# Altium project DIOT_EEM_Adapter.PrjPCB (part 2 of 2)

## Sheet Cpcis_connectors_P1_P6.SchDoc: DIOT_EEM_Adapter
size 420 x 297 mm; CheckedBy: -; DrawnBy: Marcin Kiepiela; Address1: Warsaw University of Technology; Address2: Nowowiejska 15/19 00-665 Warsaw; DocumentNumber: 2; SheetNumber: 2; SheetTotal: 6; EDA_Number: ARTIQ; Projet: ARTIQ/Sinara/DIOT; ModifiedBy: -; CheckedDate: -; Title2: -; DivGrp: ISE; Designer: Marcin Kiepiela; ModifiedDate: -; ProjectName: DIOT_EEM_Adapter.PrjPCB
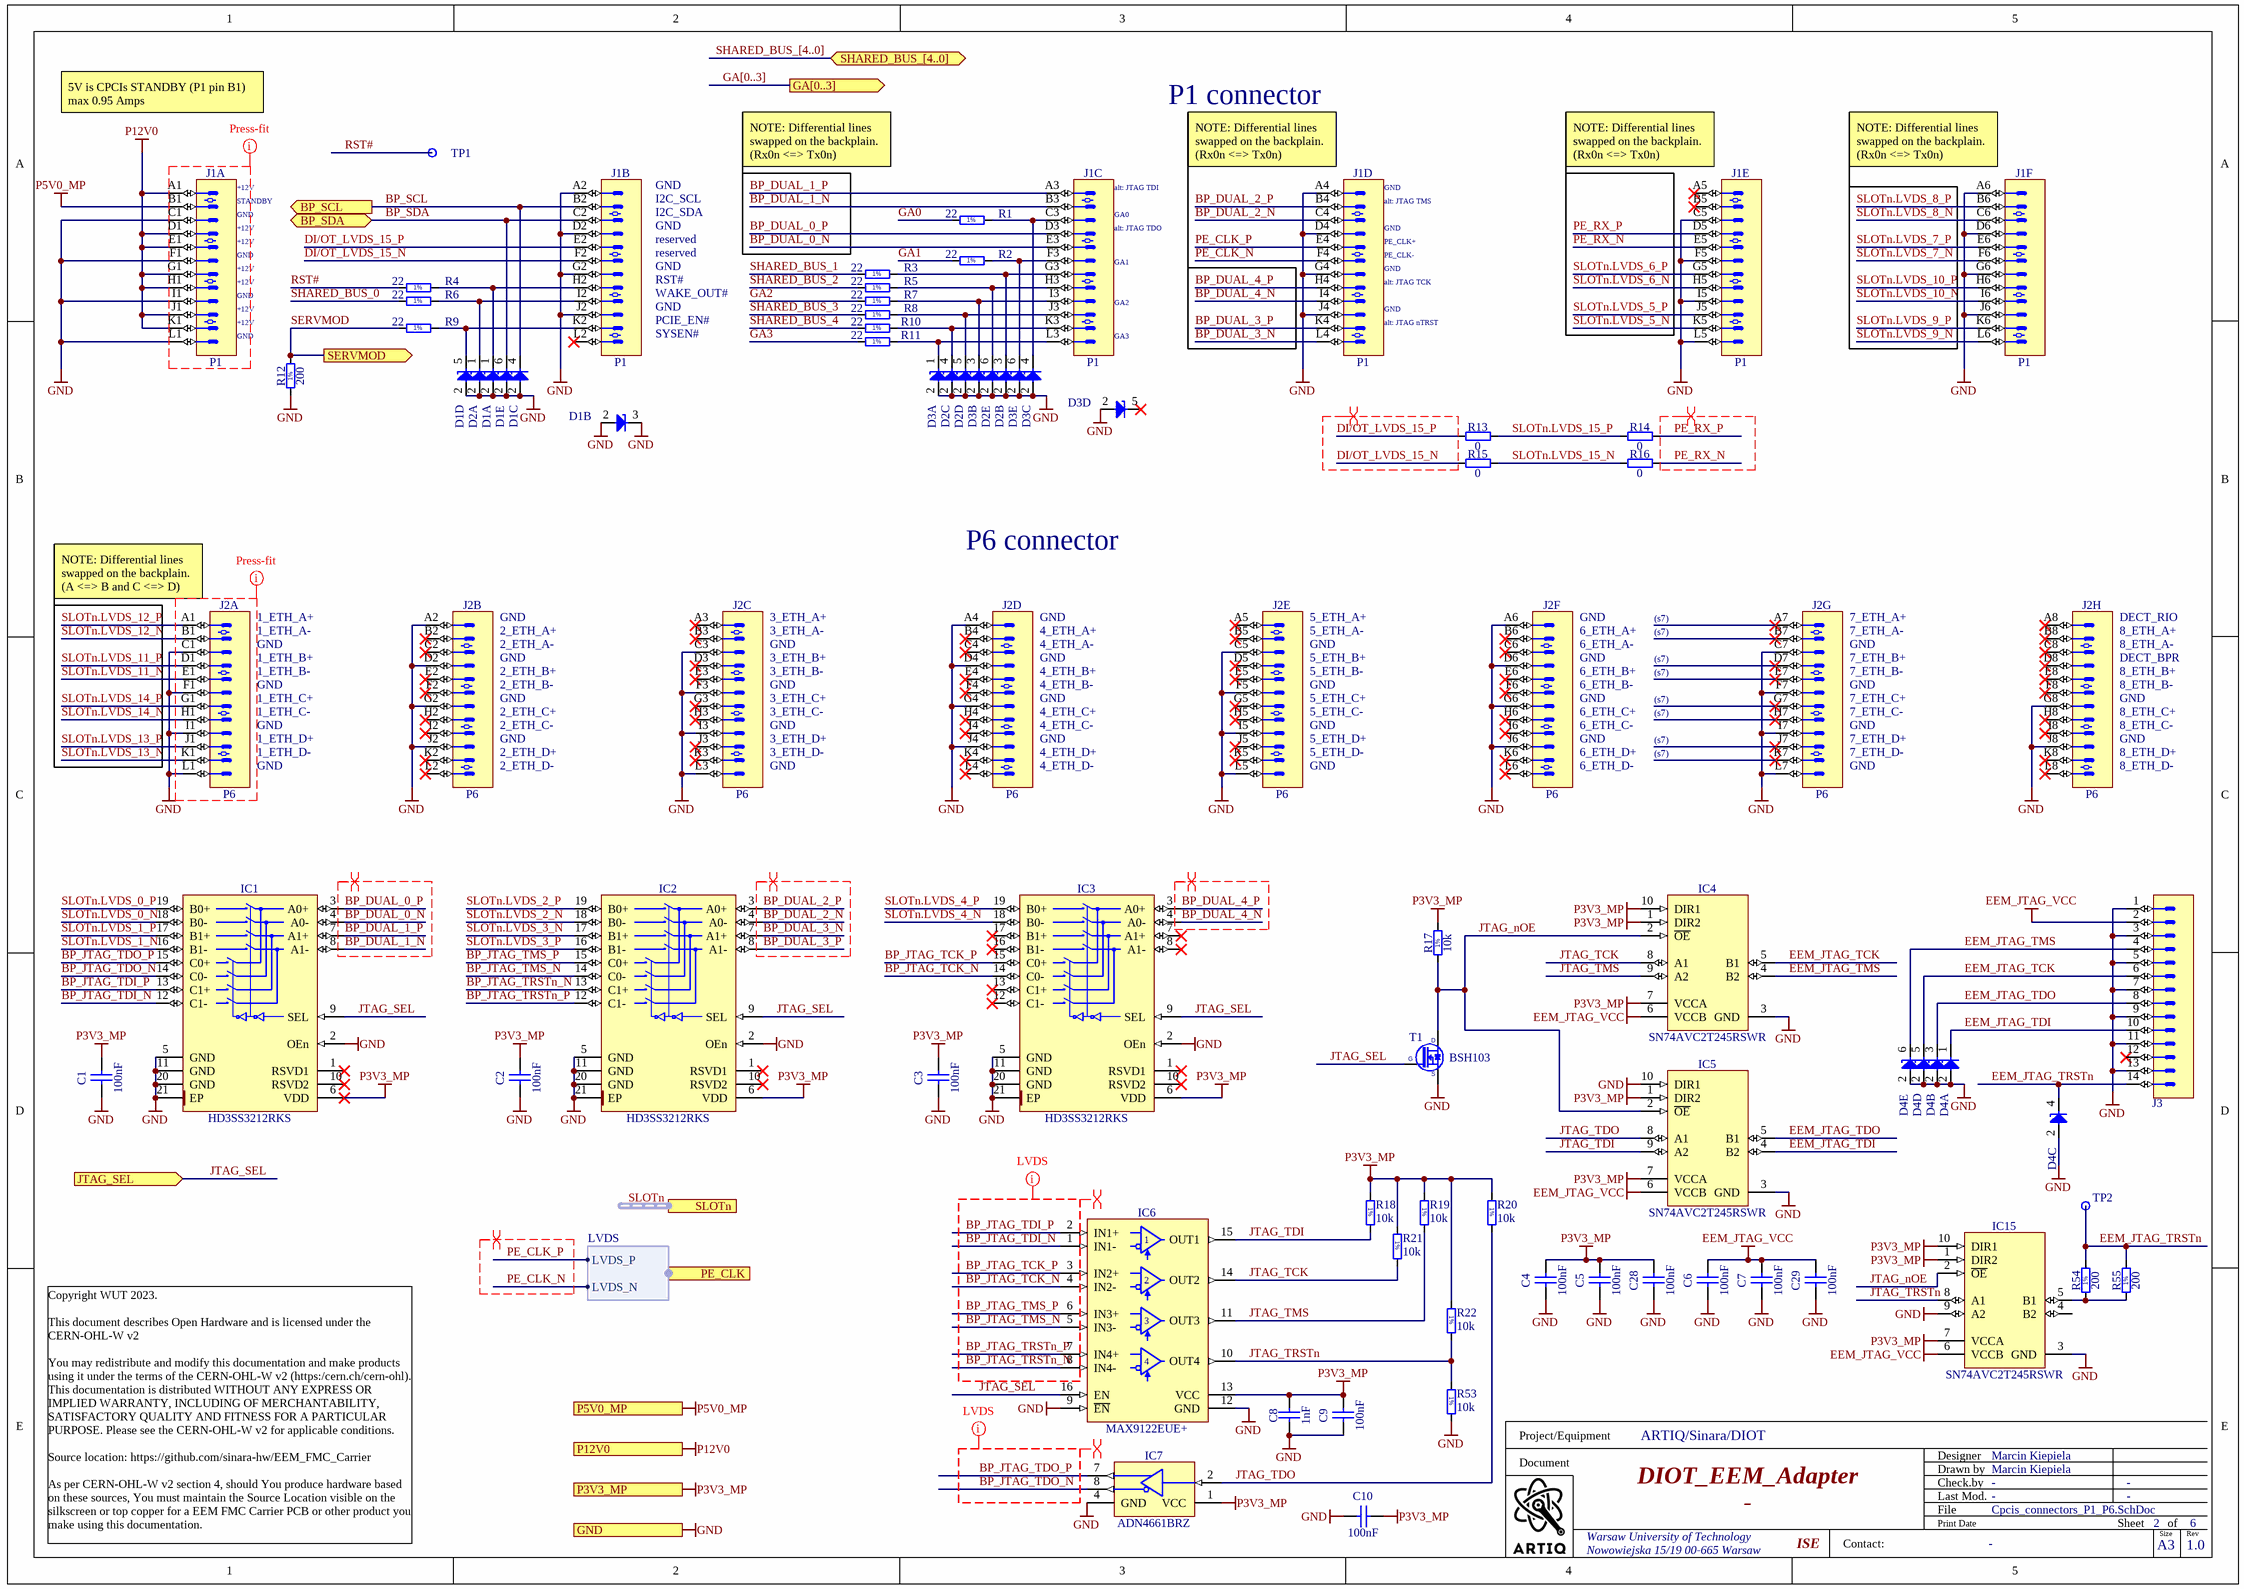
[diagram p3: Cpcis_connectors_P1_P6.SchDoc]

### Parts
C1  100nF  [CAPC1005X55N]
C2  100nF  [CAPC1005X55N]
C3  100nF  [CAPC1005X55N]
C4  100nF  [CAPC1005X55N]
C5  100nF  [CAPC1005X55N]
C6  100nF  [CAPC1005X55N]
C7  100nF  [CAPC1005X55N]
C8  1nF  [CAPC1005X55N]
C9  100nF  [CAPC1005X55N]
C10  100nF  [CAPC1005X55N]
C28  100nF  [CAPC1005X55N]
C29  100nF  [CAPC1005X55N]
D1  PESD3V3L5UY  [SOT65P210X110-6N]  (value not drawn)  (parts A,B,C,D,E of 5)
D2  PESD3V3L5UY  [SOT65P210X110-6N]  (value not drawn)  (parts A,B,C,D,E of 5)
D3  PESD3V3L5UY  [SOT65P210X110-6N]  (value not drawn)  (parts A,B,C,D,E of 5)
D4  PESD3V3L5UY  [SOT65P210X110-6N]  (value not drawn)  (parts A,B,C,D,E of 5)
IC1  HD3SS3212RKS  [TEXAS_RKS0020A]
IC2  HD3SS3212RKS  [TEXAS_RKS0020A]
IC3  HD3SS3212RKS  [TEXAS_RKS0020A]
IC4  SN74AVC2T245RSWR  [QFN40P140X180X55-10N]
IC5  SN74AVC2T245RSWR  [QFN40P140X180X55-10N]
IC6  MAX9122EUE+  [SOP65P640X110-16N]
IC7  ADN4661BRZ  [SOIC127P600X175-8N]
IC15  SN74AVC2T245RSWR  [QFN40P140X180X55-10N]
J1  P1  [AMPHENOL_10052825-101LF]  (parts A,B,C,D,E,F of 6)
J2  P6  [AMPHENOL_10052838-101LF]  (parts A,B,C,D,E,F,G,H of 8)
J3  Milli-Grid™  [MOLEX_87832-1420]  (value not drawn)
R1  22  [RESC1005X40N]
R2  22  [RESC1005X40N]
R3  22  [RESC1005X40N]
R4  22  [RESC1005X40N]
R5  22  [RESC1005X40N]
R6  22  [RESC1005X40N]
R7  22  [RESC1005X40N]
R8  22  [RESC1005X40N]
R9  22  [RESC1005X40N]
R10  22  [RESC1005X40N]
R11  22  [RESC1005X40N]
R12  200  [RESC1005X40N]
R13  0  [RESC0603X28N]
R14  0  [RESC0603X28N]
R15  0  [RESC0603X28N]
R16  0  [RESC0603X28N]
R17  10k  [RESC1005X40N]
R18  10k  [RESC1005X40N]
R19  10k  [RESC1005X40N]
R20  10k  [RESC1005X40N]
R21  10k  [RESC1005X40N]
R22  10k  [RESC1005X40N]
R53  10k  [RESC1005X40N]
R54  200  [RESC1005X40N]
R55  200  [RESC1005X40N]
T1  BSH103  [SOT95P230X110-3N]
TP1  Test Point  [TPS127]  (value not drawn)
TP2  Test Point  [TPS127]  (value not drawn)

### Ports
BP_SCL (out), BP_SDA (bidir), GA[0..3] (out), GND, JTAG_SEL (in), P3V3_MP (in), P5V0_MP (out), P12V0 (out), PE_CLK (harness LVDS), SERVMOD (out), SHARED_BUS_[4..0] (bidir), SLOTn (harness SLOT)

### Harnesses
LVDS: LVDS_P, LVDS_N

### Nets
EEM_JTAG_VCC: C6.2 C7.2 C29.2 IC4.6(VCCB) IC5.6(VCCB) IC15.6(VCCB) J3.2
GND: C1.1 C2.1 C3.1 C4.1 C5.1 C6.1 C7.1 C8.1 C9.1 C10.1 C28.1 C29.1 D1.2(A) D1.3(C) D2.2(A) D3.2(A) D4.2(A) IC1.2(OEn) IC1.5(GND) IC1.11(GND) IC1.20(GND) IC1.21(EP) IC2.2(OEn) IC2.5(GND) IC2.11(GND) IC2.20(GND) IC2.21(EP) IC3.2(OEn) IC3.5(GND) IC3.11(GND) IC3.20(GND) IC3.21(EP) IC4.3(GND) IC5.3(GND) IC5.10(DIR1) IC6.9(~{EN}) IC6.12(GND) IC7.4(GND) IC15.3(GND) IC15.9(A2) J1.A2 J1.A4 J1.A6 J1.C1 J1.C5 J1.D2 J1.D4 J1.D6 J1.F1 J1.F5 J1.G2 J1.G4 J1.G6 J1.I1 J1.I5 J1.J2 J1.J4 J1.J6 J1.L1 J1.L5 J2.A2 J2.A4 J2.A6 J2.C1 J2.C3 J2.C5 J2.C7 J2.D2 J2.D4 J2.D6 J2.F1 J2.F3 J2.F5 J2.F7 J2.G2 J2.G4 J2.G6 J2.G8 J2.I1 J2.I3 J2.I5 J2.I7 J2.J2 J2.J4 J2.J6 J2.J8 J2.L1 J2.L3 J2.L5 J2.L7 J3.1 J3.3 J3.5 J3.7 J3.9 J3.11 J3.13 R12.1 R53.1 T1.2(S) ; port GND
P3V3_MP: C1.2 C2.2 C3.2 C4.2 C5.2 C8.2 C9.2 C10.2 C28.2 IC1.6(VDD) IC2.6(VDD) IC3.6(VDD) IC4.1(DIR2) IC4.7(VCCA) IC4.10(DIR1) IC5.1(DIR2) IC5.7(VCCA) IC6.13(VCC) IC7.1(VCC) IC15.1(DIR2) IC15.7(VCCA) IC15.10(DIR1) R17.2 R18.2 R19.2 R20.2 R21.2 R22.2 ; port P3V3_MP
P5V0_MP: J1.B1 ; port P5V0_MP
P12V0: J1.A1 J1.D1 J1.E1 J1.G1 J1.H1 J1.J1 J1.K1 ; port P12V0
BP_DUAL_0_N: IC1.4(A0-) J1.E3  [project net BP_DUAL_0_N_2]
BP_DUAL_0_P: IC1.3(A0+) J1.D3  [project net BP_DUAL_0_P_2]
BP_DUAL_1_N: IC1.8(A1-) J1.B3  [project net BP_DUAL_1_N_2]
BP_DUAL_1_P: IC1.7(A1+) J1.A3  [project net BP_DUAL_1_P_2]
BP_DUAL_2_N: IC2.4(A0-) J1.C4  [project net BP_DUAL_2_N_2]
BP_DUAL_2_P: IC2.3(A0+) J1.B4  [project net BP_DUAL_2_P_2]
BP_DUAL_3_N: IC2.7(A1+) J1.L4  [project net BP_DUAL_3_N_2]
BP_DUAL_3_P: IC2.8(A1-) J1.K4  [project net BP_DUAL_3_P_2]
BP_DUAL_4_N: IC3.4(A0-) J1.I4  [project net BP_DUAL_4_N_2]
BP_DUAL_4_P: IC3.3(A0+) J1.H4  [project net BP_DUAL_4_P_2]
BP_JTAG_TCK_N: IC3.14(C0-) IC6.4(IN2-)  [project net BP_JTAG_TCK_N_2]
BP_JTAG_TCK_P: IC3.15(C0+) IC6.3(IN2+)  [project net BP_JTAG_TCK_P_2]
BP_JTAG_TDI_N: IC1.12(C1-) IC6.1(IN1-)  [project net BP_JTAG_TDI_N_2]
BP_JTAG_TDI_P: IC1.13(C1+) IC6.2(IN1+)  [project net BP_JTAG_TDI_P_2]
BP_JTAG_TDO_N: IC1.14(C0-) IC7.8(DOUT-)  [project net BP_JTAG_TDO_N_2]
BP_JTAG_TDO_P: IC1.15(C0+) IC7.7(DOUT+)  [project net BP_JTAG_TDO_P_2]
BP_JTAG_TMS_N: IC2.14(C0-) IC6.5(IN3-)  [project net BP_JTAG_TMS_N_2]
BP_JTAG_TMS_P: IC2.15(C0+) IC6.6(IN3+)  [project net BP_JTAG_TMS_P_2]
BP_JTAG_TRSTn_N: IC2.13(C1+) IC6.8(IN4-)  [project net BP_JTAG_TRSTn_N_2]
BP_JTAG_TRSTn_P: IC2.12(C1-) IC6.7(IN4+)  [project net BP_JTAG_TRSTn_P_2]
BP_SCL: D1.4(C) J1.B2 ; port BP_SCL
BP_SDA: D1.6(C) J1.C2 ; port BP_SDA
DI/OT_LVDS_15_N: J1.F2 R15.1  [project net DI/OT_LVDS_15_N_2]
DI/OT_LVDS_15_P: J1.E2 R13.1  [project net DI/OT_LVDS_15_P_2]
EEM_JTAG_TCK: D4.5(C) IC4.5(B1) J3.6  [project net EEM_JTAG_TCK_2]
EEM_JTAG_TDI: D4.1(C) IC5.4(B2) J3.10  [project net EEM_JTAG_TDI_2]
EEM_JTAG_TDO: D4.3(C) IC5.5(B1) J3.8  [project net EEM_JTAG_TDO_2]
EEM_JTAG_TMS: D4.6(C) IC4.4(B2) J3.4  [project net EEM_JTAG_TMS_2]
EEM_JTAG_TRSTn: D4.4(C) J3.14 R54.2 R55.2 TP2.1  [project net EEM_JTAG_TRSTn_2]
GA0: R1.1
GA1: R2.1
GA2: R7.1
GA3: R11.1
JTAG_nOE: IC4.2(~{OE}) IC5.2(~{OE}) IC15.2(~{OE}) R17.1 T1.3(D)  [project net JTAG_nOE_2]
JTAG_SEL: IC1.9(SEL) IC2.9(SEL) IC3.9(SEL) IC6.16(EN) T1.1(G) ; port JTAG_SEL
JTAG_TCK: IC4.8(A1) IC6.14(OUT2) R21.1  [project net JTAG_TCK_2]
JTAG_TDI: IC5.9(A2) IC6.15(OUT1) R18.1  [project net JTAG_TDI_2]
JTAG_TDO: IC5.8(A1) IC7.2(DIN) R20.1  [project net JTAG_TDO_2]
JTAG_TMS: IC4.9(A2) IC6.11(OUT3) R19.1  [project net JTAG_TMS_2]
JTAG_TRSTn: IC6.10(OUT4) IC15.8(A1) R22.1 R53.2  [project net JTAG_TRSTn_2]
PE_CLK_N: J1.F4 ; port PE_CLK.LVDS_N  [project net CK_MMCX_IN_N]
PE_CLK_P: J1.E4 ; port PE_CLK.LVDS_P  [project net CK_MMCX_IN_P]
PE_RX_N: J1.E5 R16.2  [project net PE_RX_N_2]
PE_RX_P: J1.D5 R14.2  [project net PE_RX_P_2]
RST#: R4.1 TP1.1  [project net RST#_2]
SERVMOD: R9.1 R12.2 ; port SERVMOD
SHARED_BUS_0: R6.1
SHARED_BUS_1: R3.1
SHARED_BUS_2: R5.1
SHARED_BUS_3: R8.1
SHARED_BUS_4: R10.1
SLOTn.LVDS_0_N: IC1.18(B0-)  [project net SLOTn.LVDS_0_N_2]
SLOTn.LVDS_0_P: IC1.19(B0+)  [project net SLOTn.LVDS_0_P_2]
SLOTn.LVDS_1_N: IC1.16(B1-)  [project net SLOTn.LVDS_1_N_2]
SLOTn.LVDS_1_P: IC1.17(B1+)  [project net SLOTn.LVDS_1_P_2]
SLOTn.LVDS_2_N: IC2.18(B0-)  [project net SLOTn.LVDS_2_N_2]
SLOTn.LVDS_2_P: IC2.19(B0+)  [project net SLOTn.LVDS_2_P_2]
SLOTn.LVDS_3_N: IC2.17(B1+)  [project net SLOTn.LVDS_3_N_2]
SLOTn.LVDS_3_P: IC2.16(B1-)  [project net SLOTn.LVDS_3_P_2]
SLOTn.LVDS_4_N: IC3.18(B0-)  [project net SLOTn.LVDS_4_N_2]
SLOTn.LVDS_4_P: IC3.19(B0+)  [project net SLOTn.LVDS_4_P_2]
SLOTn.LVDS_5_N: J1.K5  [project net SLOTn.LVDS_5_N_2]
SLOTn.LVDS_5_P: J1.J5  [project net SLOTn.LVDS_5_P_2]
SLOTn.LVDS_6_N: J1.H5  [project net SLOTn.LVDS_6_N_2]
SLOTn.LVDS_6_P: J1.G5  [project net SLOTn.LVDS_6_P_2]
SLOTn.LVDS_7_N: J1.F6  [project net SLOTn.LVDS_7_N_2]
SLOTn.LVDS_7_P: J1.E6  [project net SLOTn.LVDS_7_P_2]
SLOTn.LVDS_8_N: J1.C6  [project net SLOTn.LVDS_8_N_2]
SLOTn.LVDS_8_P: J1.B6  [project net SLOTn.LVDS_8_P_2]
SLOTn.LVDS_9_N: J1.L6  [project net SLOTn.LVDS_9_N_2]
SLOTn.LVDS_9_P: J1.K6  [project net SLOTn.LVDS_9_P_2]
SLOTn.LVDS_10_N: J1.I6  [project net SLOTn.LVDS_10_N_2]
SLOTn.LVDS_10_P: J1.H6  [project net SLOTn.LVDS_10_P_2]
SLOTn.LVDS_11_N: J2.E1  [project net SLOTn.LVDS_11_N_2]
SLOTn.LVDS_11_P: J2.D1  [project net SLOTn.LVDS_11_P_2]
SLOTn.LVDS_12_N: J2.B1  [project net SLOTn.LVDS_12_N_2]
SLOTn.LVDS_12_P: J2.A1  [project net SLOTn.LVDS_12_P_2]
SLOTn.LVDS_13_N: J2.K1  [project net SLOTn.LVDS_13_N_2]
SLOTn.LVDS_13_P: J2.J1  [project net SLOTn.LVDS_13_P_2]
SLOTn.LVDS_14_N: J2.H1  [project net SLOTn.LVDS_14_N_2]
SLOTn.LVDS_14_P: J2.G1  [project net SLOTn.LVDS_14_P_2]
SLOTn.LVDS_15_N: R15.2 R16.1  [project net SLOTn.LVDS_15_N_2]
SLOTn.LVDS_15_P: R13.2 R14.1  [project net SLOTn.LVDS_15_P_2]
NetD1_1: D1.1(C) J1.H2 R4.2
NetD1_5: D1.5(C) J1.K2 R9.2
NetD2_1: D2.1(C) J1.I2 R6.2
NetD2_3: D2.3(C) J1.G3 R3.2
NetD2_4: D2.4(C) J1.K3 R10.2
NetD2_5: D2.5(C) J1.J3 R8.2
NetD2_6: D2.6(C) J1.H3 R5.2
NetD3_1: D3.1(C) J1.L3 R11.2
NetD3_3: D3.3(C) J1.I3 R7.2
NetD3_4: D3.4(C) J1.C3 R1.2
NetD3_6: D3.6(C) J1.F3 R2.2
NetIC15_5: IC15.5(B1) R54.1 R55.1

Not connected (* = marked no-connect by the designer): D3 5(C)*; IC1 1(RSVD1)* 10(RSVD2)*; IC2 1(RSVD1)* 10(RSVD2)*; IC3 1(RSVD1)* 7(A1+)* 8(A1-)* 10(RSVD2)* 12(C1-)* 13(C1+)* 16(B1-)* 17(B1+)*; IC7 3(NC) 5(NC) 6(NC); IC15 4(B2); J1 A5* B5* L2*; J2 A3* A5* A7* A8* B2* B3* B4* B5* B6* B7* B8* C2* C4* C6* C8* D3* D5* D7* D8* E2* E3* E4* E5* E6* E7* E8* F2* F4* F6* F8* G3* G5* G7* H2* H3* H4* H5* H6* H7* H8* I2* I4* I6* I8* J3* J5* J7* K2* K3* K4* K5* K6* K7* K8* L2* L4* L6* L8*; J3 12*

### Buses and harness runs
bus GA[0..3] = port GA[0..3]
bus SHARED_BUS_[4..0] = port SHARED_BUS_[4..0]
harness SLOTn = port SLOTn

### Layout directives
differential pair: BP_DUAL_0_N, BP_DUAL_0_P, BP_DUAL_1_N, BP_DUAL_1_P, BP_DUAL_2_N, BP_DUAL_2_P, BP_DUAL_3_N, BP_DUAL_3_P, BP_DUAL_4_N, BP_DUAL_4_P, BP_JTAG_TCK_N, BP_JTAG_TCK_P, BP_JTAG_TDI_N, BP_JTAG_TDI_P, BP_JTAG_TDO_N, BP_JTAG_TDO_P, BP_JTAG_TMS_N, BP_JTAG_TMS_P, BP_JTAG_TRSTn_N, BP_JTAG_TRSTn_P, DI/OT_LVDS_15_N, DI/OT_LVDS_15_P, PE_CLK_N, PE_CLK_P, PE_RX_N, PE_RX_P
net class LVDS: BP_JTAG_TCK_N, BP_JTAG_TCK_P, BP_JTAG_TDI_N, BP_JTAG_TDI_P, BP_JTAG_TDO_N, BP_JTAG_TDO_P, BP_JTAG_TMS_N, BP_JTAG_TMS_P, BP_JTAG_TRSTn_N, BP_JTAG_TRSTn_P
CompClassName: Press-fit: (no net found under the mark)

### Notes on the sheet
- 5V is CPCIs STANDBY (P1 pin B1)
  max 0.95 Amps
- P1 connector
- (near J1) +12V
- GND
- NOTE: Differential lines swapped on the backplain.
  (Rx0n <=> Tx0n)
- (near J1) alt: JTAG TDI
- (near J1) NOTE: Differential lines swapped on the backplain.
  (Rx0n <=> Tx0n)
- (near J1) GND
- (near J1) STANDBY
- I2C_SCL
- I2C_SDA
- reserved
- (near J1) alt: JTAG TDO
- (near J1) GA1
- (near J1) GA0
- (near J1) alt: JTAG TMS
- (near J1) PE_CLK+
- (near J1) PE_CLK-
- +12V
- RST#
- WAKE_OUT#
- PCIE_EN#
- (near J1) GA2
- (near J1) alt: JTAG TCK
- (near J1) alt: JTAG nTRST
- SYSEN#
- (near J1) GA3
- (near J2) NOTE: Differential lines swapped on the backplain.
  (A <=> B and C <=> D)
- P6 connector
- (near J2) 1_ETH_A+
- (near J2) 1_ETH_A-
- (near J2) GND
- (near J2) 1_ETH_B+
- (near J2) 2_ETH_A+
- (near J2) 2_ETH_A-
- (near J2) 3_ETH_A+
- (near J2) 3_ETH_A-
- (near J2) 3_ETH_B+
- (near J2) 4_ETH_A+
- (near J2) 4_ETH_A-
- (near J2) 5_ETH_A+
- (near J2) 5_ETH_A-
- (near J2) 5_ETH_B+
- (near J2) 6_ETH_A+
- (near J2) 6_ETH_A-
- (s7)
- (near J2) 7_ETH_A+
- (near J2) 7_ETH_A-
- (near J2) 7_ETH_B+
- (near J2) DECT_RIO
- (near J2) 8_ETH_A+
- (near J2) 8_ETH_A-
- (near J2) DECT_BPR
- (near J2) 1_ETH_B-
- (near J2) 1_ETH_C+
- (near J2) 1_ETH_C-
- (near J2) 2_ETH_B+
- (near J2) 2_ETH_B-
- (near J2) 2_ETH_C+
- (near J2) 2_ETH_C-
- (near J2) 3_ETH_B-
- (near J2) 3_ETH_C+
- (near J2) 3_ETH_C-
- (near J2) 4_ETH_B+
- (near J2) 4_ETH_B-
- (near J2) 4_ETH_C+
- (near J2) 4_ETH_C-
- (near J2) 5_ETH_B-
- (near J2) 5_ETH_C+
- (near J2) 5_ETH_C-
- (near J2) 6_ETH_B+
- (near J2) 6_ETH_B-
- (near J2) 6_ETH_C+
- (near J2) 6_ETH_C-
- (near J2) 7_ETH_B-
- (near J2) 7_ETH_C+
- (near J2) 7_ETH_C-
- (near J2) 8_ETH_B+
- (near J2) 8_ETH_B-
- (near J2) 8_ETH_C+
- (near J2) 8_ETH_C-
- (near J2) 1_ETH_D+
- (near J2) 1_ETH_D-
- (near J2) 2_ETH_D+
- (near J2) 2_ETH_D-
- (near J2) 3_ETH_D+
- (near J2) 3_ETH_D-
- (near J2) 4_ETH_D+
- (near J2) 4_ETH_D-
- (near J2) 5_ETH_D+
- (near J2) 5_ETH_D-
- (near J2) 6_ETH_D+
- (near J2) 6_ETH_D-
- (near J2) 7_ETH_D+
- (near J2) 7_ETH_D-
- (near J2) 8_ETH_D+
- (near J2) 8_ETH_D-
- Project/Equipment
- Document
- Designer
- Drawn by
- Check.by
- Copyright WUT 2023.
  This document describes Open Hardware and is licensed under the CERN-OHL-W v2
  You may redistribute and modify this documentation and make products using it under the terms of the CERN-OHL-W v2 (https:/cern.ch/cern-ohl). This documentation is distributed WITHOUT ANY EXPRESS OR IMPLIED WARRANTY, INCLUDING OF MERCHANTABILITY, SATISFACTORY QUALITY AND FITNESS FOR A PARTICULAR PURPOSE. Please see the CERN-OHL-W v2 for applicable conditions.
  Source location: https://github.com/sinara-hw/EEM_FMC_Carrier
  As per CERN-OHL-W v2 section 4, should You produce hardware based on these sources, You must maintain the Source Location visible on the silkscreen or top copper for a EEM FMC Carrier PCB or other product you make using this documentation.
- Contact:
- File
- Last Mod.
- Print Date
- Sheet
- Size
- A3
- of
- Rev
- (in symbol R0402_10K_1%_0.0625W_100PPM) 1%
- (in symbol R0402_22R_1%_0.0625W_100PPM) 1%
- (in symbol R0402_200R_1%_0.0625W_100PPM) 1%

### Library data of the parts
C1-C7 C9 C10 C28 C29 = CC0402_100NF_16V_10%_X7R: Non-polarised capacitor; Part Description: SMD Multilayer Chip Ceramic Capacitor; Manufacturer: GENERIC; Manufacturer1 Part Number: GRM155R71C104KA88D; Voltage: 16V; TC: X7R; Tolerance: ±10%; Part Number: CC0402_100NF_16V_10%_X7R; Component Kind: Standard; Component Type: Standard; Pin Count: 2; Value: 100nF; Status: Not Recommended; Manufacturer Part Number: CC0402_100NF_16V_10%_X7R; Case: 0402; Mounted: Yes; Socket: No; SMD: Yes; Sense: No; HelpURL: \\cern.ch\dfs\Applications\Altium\Datasheets\CC0402_X7R_MURATA_GRM.pdf; Author: CERN DEM JLC; CreateDate: 05.12.2013; LatestRevisionDate: 03.12.2007; Manufacturer1 Example: MURATA; Manufacturer1 ComponentHeight: 0.55mm
C8 = CC0402_1NF_50V_10%_X7R: Non-polarised capacitor; Manufacturer: GENERIC; Part Description: SMD Multilayer Chip Ceramic Capacitor; Manufacturer1 Part Number: 223858715623; Tolerance: ±10%; Voltage: 50V; TC: X7R; Manufacturer Part Number: CC0402_1NF_50V_10%_X7R; Part Number: CC0402_1NF_50V_10%_X7R; Value: 1nF; Component Kind: Standard; Component Type: Standard; Pin Count: 2; Status: Not Recommended; Case: 0402; Mounted: Yes; Socket: No; SMD: Yes; Sense: No; Manufacturer1 Example: PHYCOMP; Manufacturer1 ComponentHeight: 0.55mm; HelpURL: \\cern.ch\dfs\Applications\Altium\Datasheets\CC0402_X7R_PHYCOMP.pdf; Author: CERN DEM JLC; CreateDate: 03.12.2007; LatestRevisionDate: 03.12.2007
D1-D4 = PESD3V3L5UY: Fivefold ESD Protection Diode Arrays; Part Description: Fivefold ESD Protection Diode Arrays (30kV); Manufacturer: NEXPERIA; Voltage: 3.3V; Power: 200W; PressFit: No; Bonding: No; Part Number: PESD3V3L5UY; Component Kind: Standard; Component Type: Standard; Device: PESD3V3L5UY; PackageDescription: SOT363, SC-88, 0.65mm Pitch; 6 Pin, 1.25mm W X 2.00mm L X 1.10mm H body, IPC Medium Density; Manufacturer Part Number: PESD3V3L5UY; Pin Count: 6; Case: SOT363; Mounted: Yes; Socket: No; SMD: Yes; Sense: No; ComponentHeight: 1.1mm; HelpURL: \\cern.ch\dfs\Applications\Altium\Datasheets\PESD3V3L5UY.pdf; Author: CERN DEM WB; CreateDate: 05.07.2021; LatestRevisionDate: 05.07.2021
IC1-IC3 = HD3SS3212RKS: Two-Channel Differential 2:1/1:2 USB3.1 Mux/Demux; Manufacturer: TEXAS INSTRUMENTS; PressFit: No; Bonding: No; Part Number: HD3SS3212RKS; Component Kind: Standard; Component Type: Standard; Device: HD3SS3212RKS; PackageDescription: QFN, TEXAS Case Style RKS, 0.50mm Pitch, Rect.; 20 Pin, 2.50mm L X 4.50mm W X 1.00mm H body (w/Thermal Tab 1.1mm X 3.1mm); Part Description: Two-Channel Differential 2:1/1:2 USB3.1 Mux/Demux; Manufacturer Part Number: HD3SS3212RKS; Pin Count: 21; Case: TQFN20; Mounted: Yes; Socket: No; SMD: Yes; Sense: No; ComponentHeight: 1mm; Author: CERN DEM BC; HelpURL: \\cern.ch\dfs\Applications\Altium\Datasheets\HD3SS3212RKS.pdf; CreateDate: 2019-11-06; LatestRevisionDate: 2019-11-06
IC4 IC5 IC15 = SN74AVC2T245RSWR: Dual-Bit Dual-Supply Bus Transceiver With Configurable Voltage Translation and 3-State Outputs; Manufacturer: TEXAS INSTRUMENTS; PressFit: No; Bonding: No; Part Number: SN74AVC2T245RSWR; Component Kind: Standard; Component Type: Standard; Device: SN74AVC2T245RSWR; PackageDescription: QFN, 0.40mm Pitch, Rect.;10 Pin, 1.80mm L X 1.40mm W X 0.55mm H Body, IPC Medium Density; Status: Not Recommended; Part Description: Dual-Bit Dual-Supply Bus Transceiver With Configurable Voltage Translation and 3-State Outputs; Manufacturer Part Number: SN74AVC2T245RSWR; Pin Count: 10; Case: QFN10; Mounted: Yes; Socket: No; SMD: Yes; Sense: No; ComponentHeight: 0.55mm; Author: CERN DEM JLC; HelpURL: \\cern.ch\dfs\Applications\Altium\Datasheets\SN74AVC2T245RSWR.pdf; CreateDate: 07.07.2014; LatestRevisionDate: 30.03.2017
IC6 = MAX9122EUE+: Quad LVDS Line Receivers with Integrated Termination and Flow-Through Pinout; Manufacturer: MAXIM; PressFit: No; Bonding: No; Part Number: MAX9122EUE+; Component Kind: Standard; Component Type: Standard; Device: MAX9122EUE+; PackageDescription: SOP, 0.65mm Pitch; 16 Pin, 4.40mm W X 5.00mm L X 1.10mm H body, IPC Medium Density; Part Description: Quad LVDS Line Receivers with Integrated Termination and Flow-Through Pinout; Manufacturer Part Number: MAX9122EUE+; Pin Count: 16; Case: TSSOP16; Mounted: Yes; Socket: No; SMD: Yes; Sense: No; ComponentHeight: 1.1mm; Author: CERN DEM MR; HelpURL: \\cern.ch\dfs\Applications\Altium\Datasheets\MAX9122EUE+.pdf; CreateDate: 2015-12-14; LatestRevisionDate: 2015-12-14
IC7 = ADN4661BRZ: Single, 3V, CMOS, LVDS, High Speed Differential Driver; Manufacturer: ANALOG DEVICES; PressFit: No; Bonding: No; Part Number: ADN4661BRZ; Component Kind: Standard; Component Type: Standard; Device: ADN4661BRZ; PackageDescription: SOIC 8, Pitch 1.27mm - Body 4x5mm, IPC Medium Density; Part Description: Single, 3V, CMOS, LVDS, High Speed Differential Driver; Manufacturer Part Number: ADN4661BRZ; Pin Count: 8; Case: SOIC8; Mounted: Yes; Socket: No; SMD: Yes; Sense: No; ComponentHeight: 1.75mm; Author: CERN DEM JMW; HelpURL: \\cern.ch\dfs\Applications\Altium\Datasheets\ADN4661BRZ.pdf; CreateDate: 2014-02-26; LatestRevisionDate: 2014-02-26
J1 = AMPHENOL_10052825-101LF: 72 Contacts Header, 6 Columns, 4 Pairs per Column; Part Description: 72 Contacts, 2mm Pitch, 6 Columns, 4 Pairs per Column, 4 Walls, Right Angle Header; Part Number: AMPHENOL_10052825-101LF; Component Kind: Standard; Component Type: Standard; Pin Count: 72; Family: AirMax VS; Mounted: Yes; Socket: No; SMD: No; PressFit: Yes; Sense: No; Status: None; Manufacturer: AMPHENOL; Manufacturer Part Number: 10052825-101LF; ComponentHeight: 15.35mm; HelpURL: \\cern.ch\dfs\Applications\Altium\Datasheets\AMPHENOL_10052825-101LF.pdf; ComponentLink1URL: \\cern.ch\dfs\Applications\Altium\Datasheets\AMPHENOL_10052825-101LF_Application.pdf; ComponentLink1Description: Application; Author: CERN DEM MR; CreateDate: 19/02/2018; LatestRevisionDate: 19/02/2018; Classname: Overlapping
J2 = AMPHENOL_10052838-101LF: 96 Contacts Header, 8 Columns, 4 Pairs per Column; Part Description: 96 Contacts, 2mm Pitch, 8 Columns, 4 Pairs per Column, 4 Walls, Right Angle Header; Part Number: AMPHENOL_10052838-101LF; Component Kind: Standard; Component Type: Standard; Pin Count: 96; Family: AirMax VS; Mounted: Yes; Socket: No; SMD: No; PressFit: Yes; Sense: No; Status: None; Manufacturer: AMPHENOL; Manufacturer Part Number: 10052838-101LF; ComponentHeight: 15.35mm; HelpURL: \\cern.ch\dfs\Applications\Altium\Datasheets\AMPHENOL_10052838-101LF.pdf; ComponentLink1URL: \\cern.ch\dfs\Applications\Altium\Datasheets\AMPHENOL_10052838-101LF_Application.pdf; ComponentLink1Description: Application; Author: CERN DEM MR; CreateDate: 19/02/2018; LatestRevisionDate: 19/02/2018; Classname: Overlapping
J3 = MOLEX_87832-1420: Connector 14 Male; Part Description: 2.00mm (.079") Pitch Milli-Grid™ Header, Surface Mount, Vertical, Shrouded, 14 Circuits,with Locking Windows and Centre Polarization Slot, PCB Locator; Manufacturer: MOLEX; PressFit: No; Part Number: MOLEX_87832-1420; Component Kind: Standard; Component Type: Standard; Pin Count: 14; Family: Milli-Grid™; Mounted: Yes; Socket: No; SMD: Yes; Sense: No; Status: None; Manufacturer Part Number: 87832-1420; ComponentHeight: 7.6mm; HelpURL: \\cern.ch\dfs\Applications\Altium\Datasheets\MOLEX_87832-1420.pdf; Author: CERN DEM JLC; CreateDate: 09.09.2008; LatestRevisionDate: 09.09.2008
R1-R11 = R0402_22R_1%_0.0625W_100PPM: Resistor - 1%; Part Description: General Purpose Thick Film Chip Resistor; Manufacturer: GENERIC; Manufacturer1 Part Number: 232270672209L; TC: ±100ppm/°C; PressFit: No; Part Number: R0402_22R_1%_0.0625W_100PPM; Component Kind: Standard; Component Type: Standard; Pin Count: 2; Value: 22; Status: Not Recommended; Power: 0.0625W; Tolerance: ±1%; Manufacturer Part Number: R0402_22R_1%_0.0625W_100PPM; Case: 0402; Mounted: Yes; Socket: No; SMD: Yes; Manufacturer1 Example: YAGEO PHYCOMP; Manufacturer1 ComponentHeight: 0.4mm; HelpURL: \\cern.ch\dfs\Applications\Altium\Datasheets\R0402_Phycomp_RC0402.pdf; Author: CERN DEM JLC; CreateDate: 03.12.2007; LatestRevisionDate: 17.10.2012; Sense: No
R12 R54 R55 = R0402_200R_1%_0.0625W_100PPM: Resistor - 1%; Part Description: General Purpose Thick Film Chip Resistor; Manufacturer: GENERIC; Manufacturer1 Part Number: 232270672001L; TC: ±100ppm/°C; PressFit: No; Part Number: R0402_200R_1%_0.0625W_100PPM; Component Kind: Standard; Component Type: Standard; Pin Count: 2; Value: 200; Status: Not Recommended; Power: 0.0625W; Tolerance: ±1%; Manufacturer Part Number: R0402_200R_1%_0.0625W_100PPM; Case: 0402; Mounted: Yes; Sense: No; Socket: No; SMD: Yes; Manufacturer1 Example: YAGEO PHYCOMP; Manufacturer1 ComponentHeight: 0.4mm; HelpURL: \\cern.ch\dfs\Applications\Altium\Datasheets\R0402_Phycomp_RC0402.pdf; Author: CERN DEM JLC; CreateDate: 2007-12-03; LatestRevisionDate: 2012-10-17
R13-R16 = R0201_0R_JUMPER: Resistor; Part Description: 1A (0.05R Max DC Resistance) Zero Ohm Jumper; Manufacturer: GENERIC; Manufacturer1 Part Number: CRCW02010000Z0ED; PressFit: No; Part Number: R0201_0R_JUMPER; Component Kind: Standard; Component Type: Standard; Pin Count: 2; Value: 0; Status: Not Recommended; Manufacturer Part Number: R0201_0R_JUMPER; Case: 0201; Mounted: Yes; Sense: No; Socket: No; SMD: Yes; Manufacturer1 Example: VISHAY; Manufacturer1 ComponentHeight: 0.27mm; HelpURL: \\cern.ch\dfs\Applications\Altium\Datasheets\R0201_VISHAY_CRCW e3.pdf; Author: CERN DEM JLC; CreateDate: 19.11.2014; LatestRevisionDate: 08.01.2015
R17 = R0402_10K_1%_0.0625W_100PPM: Resistor - 1%; Part Description: General Purpose Thick Film Chip Resistor; Manufacturer: GENERIC; Manufacturer1 Part Number: 232270671003L; TC: ±100ppm/°C; PressFit: No; Part Number: R0402_10K_1%_0.0625W_100PPM; Component Kind: Standard; Component Type: Standard; Pin Count: 2; Value: 10k; Status: Not Recommended; Power: 0.0625W; Tolerance: ±1%; Manufacturer Part Number: R0402_10K_1%_0.0625W_100PPM; Case: 0402; Mounted: Yes; Sense: No; Socket: No; SMD: Yes; Manufacturer1 Example: YAGEO PHYCOMP; Manufacturer1 ComponentHeight: 0.4mm; HelpURL: \\cern.ch\dfs\Applications\Altium\Datasheets\R0402_Phycomp_RC0402.pdf; Author: CERN DEM JLC; CreateDate: 2007-12-03; LatestRevisionDate: 2012-10-17
R18-R22 R53 = R0402_10K_1%_0.0625W_100PPM: Resistor - 1%; Part Description: General Purpose Thick Film Chip Resistor; Manufacturer: GENERIC; Manufacturer1 Part Number: 232270671003L; TC: ±100ppm/°C; Part Number: R0402_10K_1%_0.0625W_100PPM; Component Kind: Standard; Component Type: Standard; Pin Count: 2; Value: 10k; Status: Not recommended; Power: 0.0625W; Tolerance: ±1%; Manufacturer Part Number: R0402_10K_1%_0.0625W_100PPM; Case: 0402; Mounted: Yes; Sense: No; Socket: No; SMD: Yes; Manufacturer1 Example: YAGEO PHYCOMP; Manufacturer1 ComponentHeight: 0.4mm; HelpURL: \\cern.ch\dfs\Applications\Altium\Datasheets\R0402_Phycomp_RC0402.pdf; Author: CERN DEM JLC; CreateDate: 03.12.2007; LatestRevisionDate: 17.10.2012
T1 = BSH103: N-CHANNEL MOSFET WITH DIODE; Part Description: 30V 850mA N-Channel Enhancement Mode Field-Effect Transistor; Manufacturer: NEXPERIA; PressFit: No; Bonding: No; Part Number: BSH103; Component Kind: Standard; Component Type: Standard; Device: BSH103; PackageDescription: SOT23, 3 pin, Pitch 0.95mm - 1.3mm W X 2.9mm L X 1.1mm H, IPC Medium Density; Manufacturer Part Number: BSH103; Pin Count: 3; Case: SOT23-3; Mounted: Yes; Socket: No; SMD: Yes; Sense: No; ComponentHeight: 1.1mm; HelpURL: \\cern.ch\dfs\Applications\Altium\Datasheets\BSH103.pdf; Author: CERN DEM JLC; CreateDate: 16.03.2010; LatestRevisionDate: 20.06.2017; ClassName: Artix
TP1 TP2 = SMD_PAD_1.27X1.27MM: Part Description: 1.27mm x 1.27mm PCB Copper Area (SMD Test Point); Mounted: No; Part Number: SMD_PAD_1.27X1.27MM; Component Kind: Standard (No BOM); Component Type: Standard (No BOM); Pin Count: 1; Family: Test Point; Socket: No; SMD: No; Sense: No; Status: None; ComponentHeight: 0mm; HelpURL: Undefined; Author: CERN DEM JLC; CreateDate: 12.01.2008; LatestRevisionDate: 12.01.2008; PackageDescription: 1.27mm x 1.27mm PCB Copper Area (SMD Test Point)

## Sheet Supply.SchDoc: DIOT_EEM_Adapter
size 420 x 297 mm; CheckedBy: -; DrawnBy: Marcin Kiepiela; Address1: Warsaw University of Technology; Address2: Nowowiejska 15/19 00-665 Warsaw; DocumentNumber: 5; SheetNumber: 5; SheetTotal: 6; EDA_Number: ARTIQ; Projet: ARTIQ/Sinara/DIOT; ModifiedBy: -; CheckedDate: -; Title2: -; DivGrp: ISE; Designer: Marcin Kiepiela; ModifiedDate: -; ProjectName: DIOT_EEM_Adapter.PrjPCB
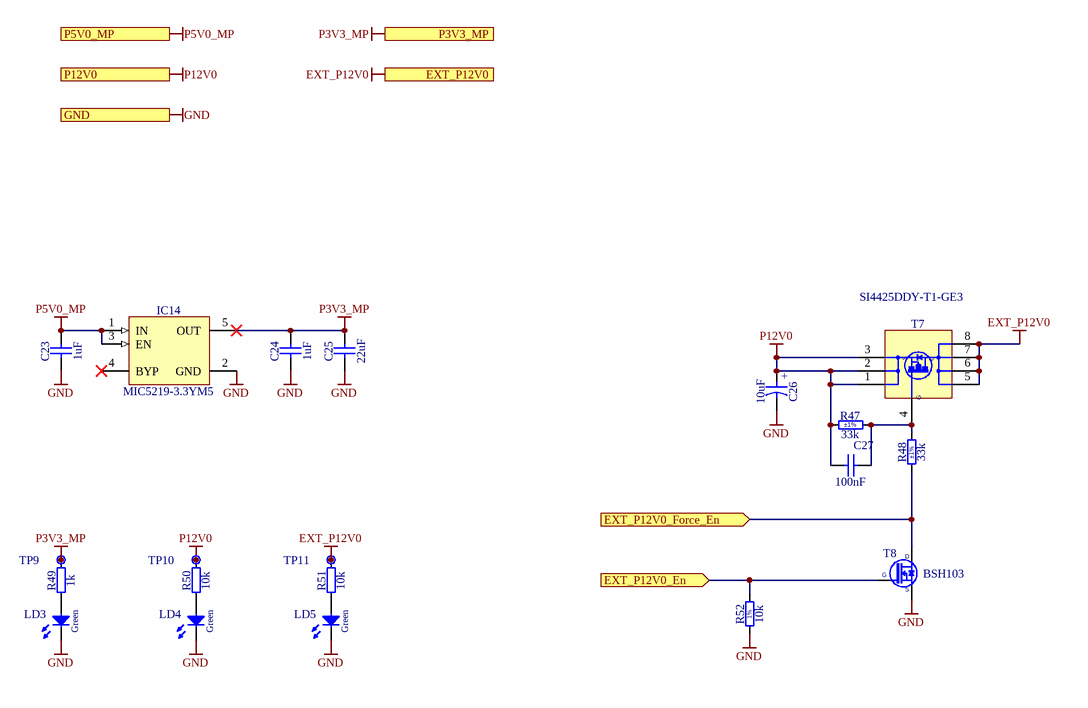
[diagram p4: Supply.SchDoc]

### Parts
C23  1uF  [CAPC1608X87N]
C24  1uF  [CAPC1608X87N]
C25  22uF  [CAPC1608X90N]
C26  10uF  [CAPMP6032X280N]
C27  100nF  [CAPC1005X55N]
IC14  MIC5219-3.3YM5  [SOT95P280X145-5N]
LD3  Green  [LED_KINGBRIGHT_KPH-1608CGCK]
LD4  Green  [LED_KINGBRIGHT_KPH-1608CGCK]
LD5  Green  [LED_KINGBRIGHT_KPH-1608CGCK]
R47  33k  Tolerance: ±1%  [RESC1005X40N]
R48  33k  Tolerance: ±1%  [RESC1005X40N]
R49  1k  [RESC1005X40N]
R50  10k  [RESC1005X40N]
R51  10k  [RESC1005X40N]
R52  10k  [RESC1005X40N]
T7  SI4425DDY-T1-GE3  [SOIC127P600X175-8N]
T8  BSH103  [SOT95P230X110-3N]
TP9  Test Point  [TPS127]  (value not drawn)
TP10  Test Point  [TPS127]  (value not drawn)
TP11  Test Point  [TPS127]  (value not drawn)

### Ports
EXT_P12V0 (out), EXT_P12V0_En (in), EXT_P12V0_Force_En (in), GND, P3V3_MP (out), P5V0_MP (in), P12V0 (in)

### Nets
EXT_P12V0: R51.2 T7.5(D) T7.6(D) T7.7(D) T7.8(D) TP11.1 ; port EXT_P12V0
GND: C23.1 C24.1 C25.1 C26.2 IC14.2(GND) LD3.1(C) LD4.1(C) LD5.1(C) R52.1 T8.2(S) ; port GND
P3V3_MP: C24.2 C25.2 IC14.5(OUT) R49.2 TP9.1 ; port P3V3_MP
P5V0_MP: C23.2 IC14.1(IN) IC14.3(EN) ; port P5V0_MP
P12V0: C26.1 C27.1 R47.1 R50.2 T7.1(S) T7.2(S) T7.3(S) TP10.1 ; port P12V0
EEM_P12V0_En: R52.2 T8.1(G) ; port EXT_P12V0_En
EXT_P12V0_Force_En: R48.1 T8.3(D) ; port EXT_P12V0_Force_En
NetC27_2: C27.2 R47.2 R48.2 T7.4(S)
NetLD3_2: LD3.2(A) R49.1
NetLD4_2: LD4.2(A) R50.1
NetLD5_2: LD5.2(A) R51.1

Not connected (* = marked no-connect by the designer): IC14 4(BYP)*

### Notes on the sheet
- Project/Equipment
- Document
- Designer
- Drawn by
- Check.by
- Copyright WUT 2023.
  This document describes Open Hardware and is licensed under the CERN-OHL-W v2
  You may redistribute and modify this documentation and make products using it under the terms of the CERN-OHL-W v2 (https:/cern.ch/cern-ohl). This documentation is distributed WITHOUT ANY EXPRESS OR IMPLIED WARRANTY, INCLUDING OF MERCHANTABILITY, SATISFACTORY QUALITY AND FITNESS FOR A PARTICULAR PURPOSE. Please see the CERN-OHL-W v2 for applicable conditions.
  Source location: https://github.com/sinara-hw/EEM_FMC_Carrier
  As per CERN-OHL-W v2 section 4, should You produce hardware based on these sources, You must maintain the Source Location visible on the silkscreen or top copper for a EEM FMC Carrier PCB or other product you make using this documentation.
- Contact:
- File
- Last Mod.
- Print Date
- Sheet
- Size
- A3
- of
- Rev
- (in symbol CTE6032-28_10UF_25V_10%_LESR0500) +
- (in symbol R0402_10K_1%_0.0625W_100PPM) 1%
- (in symbol SI4425DDY-T1-GE3) G

### Library data of the parts
C23 C24 = CC0603_1UF_25V_10%_X7R: Non-polarised capacitor; Part Description: SMD Multilayer Chip Ceramic Capacitor; Manufacturer: GENERIC; Manufacturer1 Part Number: GRM188R71E105KA12D; Voltage: 25V; TC: X7R; Tolerance: ±10%; Part Number: CC0603_1UF_25V_10%_X7R; Component Kind: Standard; Component Type: Standard; Pin Count: 2; Value: 1uF; Status: None; Manufacturer Part Number: CC0603_1UF_25V_10%_X7R; Case: 0603; Mounted: Yes; Socket: No; SMD: Yes; Sense: No; Manufacturer1 Example: MURATA; Manufacturer1 ComponentHeight: 0.9mm; HelpURL: \\cern.ch\dfs\Applications\Altium\Datasheets\CC0603_X7R_MURATA.pdf; Author: CERN DEM JLC; CreateDate: 18.01.2011; LatestRevisionDate: 18.01.2011
C25 = CC0603_22UF_6.3V_20%_X5R: Non-polarised capacitor; Part Description: SMD Multilayer Chip Ceramic Capacitor; Manufacturer: GENERIC; Manufacturer1 Part Number: C1608X5R0J226M080; Voltage: 6.3V; TC: X5R; Tolerance: ±20%; Part Number: CC0603_22UF_6.3V_20%_X5R; Component Kind: Standard; Component Type: Standard; Pin Count: 2; Value: 22uF; Status: None; Manufacturer Part Number: CC0603_22UF_6.3V_20%_X5R; Case: 0603; Mounted: Yes; Socket: No; SMD: Yes; Sense: No; Manufacturer1 Example: TDK; Manufacturer1 ComponentHeight: 0.9mm; HelpURL: \\cern.ch\dfs\Applications\Altium\Datasheets\CC0603_X5R_TDK_C.pdf; Author: CERN DEM JLC; CreateDate: 16.12.2013; LatestRevisionDate: 03.12.2020
C26 = CTE6032-28_10UF_25V_10%_LESR0500: Polarised capacitor; Part Description: Low ESR 0R5 Solid Tantalum Chip Capacitor; Manufacturer: GENERIC; Manufacturer1 Part Number: TPSC106K025R0500; Voltage: 25V; Tolerance: ±10%; Part Number: CTE6032-28_10UF_25V_10%_LESR0500; Component Kind: Standard; Component Type: Standard; Pin Count: 2; Value: 10uF; Status: Preferred; Manufacturer Part Number: CTE6032-28_10UF_25V_10%_LESR0500; Case: C; Mounted: Yes; Socket: No; SMD: Yes; Sense: No; Manufacturer1 Example: AVX; Manufacturer1 ComponentHeight: 2.8mm; HelpURL: \\cern.ch\dfs\Applications\Altium\Datasheets\CTE-LESR_AVX_TPS.pdf; Author: CERN DEM JLC; CreateDate: 05/05/2008; LatestRevisionDate: 20/01/2009
C27 = CC0402_100NF_16V_10%_X7R: as C1 on sheet Cpcis_connectors_P1_P6; Part Number: CC0402_100NF_16V_10%_X7R; Component Kind: Standard; Component Type: Standard; Pin Count: 2; Value: 100nF; Status: Not Recommended; Manufacturer Part Number: CC0402_100NF_16V_10%_X7R; Case: 0402; Mounted: Yes; Socket: No; SMD: Yes; Sense: No; Manufacturer1 Example: MURATA; Manufacturer1 ComponentHeight: 0.55mm; HelpURL: \\cern.ch\dfs\Applications\Altium\Datasheets\CC0402_X7R_MURATA_GRM.pdf; Author: CERN DEM JLC; CreateDate: 05.12.2013; LatestRevisionDate: 03.12.2007
IC14 = MIC5219-3.3YM5: 500mA Peak Output LDO Regulator; Part Description: 3.3V 500mA Peak Output Low Drop-Out  (LDO) Regulator; Manufacturer: MICROCHIP TECHNOLOGY; PressFit: No; Bonding: No; Part Number: MIC5219-3.3YM5; Component Kind: Standard; Component Type: Standard; Device: MIC5219-3.3YM5; PackageDescription: SOT, 0.95mm pitch; 5 pin, 1.60mm W X 2.90mm L X 1.45mm H body, IPC Medium Density; Manufacturer Part Number: MIC5219-3.3YM5; Pin Count: 5; Case: SOT23-5; Mounted: Yes; Socket: No; SMD: Yes; Sense: No; ComponentHeight: 1.45mm; HelpURL: \\cern.ch\dfs\Applications\Altium\Datasheets\MIC5219-3.3YM5.pdf; Author: CERN DEM WB; CreateDate: 2019-04-16; LatestRevisionDate: 2019-04-16
LD3-LD5 = LED_KINGBRIGHT_KPH-1608CGCK: LED Green 1C 2A; Part Description: SMD Green LED, Case 1.6mmX0.8mm(0603), 0.65mm Thickness; PressFit: No; Bonding: No; Manufacturer Part Number: KPH-1608CGCK; ComponentHeight: 0.65mm; HelpURL: \\cern.ch\dfs\Applications\Altium\Datasheets\LED_KINGBRIGHT_KPH-1608CGCK.pdf; Part Number: LED_KINGBRIGHT_KPH-1608CGCK; Component Kind: Standard; Component Type: Standard; Color: Green; PackageDescription: SMT Green LED, Case 0603, Body L 1.6 x W 0.8mm H 0.65mm; Manufacturer: KINGBRIGHT; Pin Count: 2; Mounted: Yes; Socket: No; SMD: Yes; Sense: No; Author: CERN DEM JLC; CreateDate: 03.07.2017; LatestRevisionDate: 03.07.2017
R47 R48 = R0402_33K_1%_0.0625W_100PPM: Resistor - 1%; Part Description: General Purpose Thick Film Chip Resistor; Manufacturer: GENERIC; Manufacturer1 Part Number: 232270673303L; TC: ±100ppm/°C; PressFit: No; Part Number: R0402_33K_1%_0.0625W_100PPM; Component Kind: Standard; Component Type: Standard; Pin Count: 2; Value: 33k; Status: Not Recommended; Power: 0.0625W; Manufacturer Part Number: R0402_33K_1%_0.0625W_100PPM; Case: 0402; Mounted: Yes; Sense: No; Socket: No; SMD: Yes; Manufacturer1 Example: YAGEO PHYCOMP; Manufacturer1 ComponentHeight: 0.4mm; HelpURL: \\cern.ch\dfs\Applications\Altium\Datasheets\R0402_Phycomp_RC0402.pdf; Author: CERN DEM JLC; CreateDate: 03.12.2007; LatestRevisionDate: 17.10.2012
R49 = R0402_1K_1%_0.0625W_100PPM: Resistor - 1%; Part Description: General Purpose Thick Film Chip Resistor; Manufacturer: GENERIC; Manufacturer1 Part Number: 232270671002L; TC: ±100ppm/°C; PressFit: No; Part Number: R0402_1K_1%_0.0625W_100PPM; Component Kind: Standard; Component Type: Standard; Pin Count: 2; Value: 1k; Status: Not Recommended; Power: 0.0625W; Tolerance: ±1%; Manufacturer Part Number: R0402_1K_1%_0.0625W_100PPM; Case: 0402; Mounted: Yes; Sense: No; Socket: No; SMD: Yes; Manufacturer1 Example: YAGEO PHYCOMP; Manufacturer1 ComponentHeight: 0.4mm; HelpURL: \\cern.ch\dfs\Applications\Altium\Datasheets\R0402_Phycomp_RC0402.pdf; Author: CERN DEM JLC; CreateDate: 03.12.2007; LatestRevisionDate: 17.10.2012
R50-R52 = R0402_10K_1%_0.0625W_100PPM: as R17 on sheet Cpcis_connectors_P1_P6; Part Number: R0402_10K_1%_0.0625W_100PPM; Component Kind: Standard; Component Type: Standard; Pin Count: 2; Value: 10k; Status: Not Recommended; Power: 0.0625W; Tolerance: ±1%; Manufacturer Part Number: R0402_10K_1%_0.0625W_100PPM; Case: 0402; Mounted: Yes; Sense: No; Socket: No; SMD: Yes; Manufacturer1 Example: YAGEO PHYCOMP; Manufacturer1 ComponentHeight: 0.4mm; HelpURL: \\cern.ch\dfs\Applications\Altium\Datasheets\R0402_Phycomp_RC0402.pdf; Author: CERN DEM JLC
  R50 R51: CreateDate: 03.12.2007; LatestRevisionDate: 17.10.2012
  R52: CreateDate: 2007-12-03; LatestRevisionDate: 2012-10-17
T7 = SI4425DDY-T1-GE3: -30V -19.7A P-Channel MOSFET; Manufacturer: VISHAY SILICONIX; PressFit: No; Bonding: No; Part Number: SI4425DDY-T1-GE3; Component Kind: Standard; Component Type: Standard; Device: SI4425DDY-T1-GE3; PackageDescription: SOIC 8, Pitch 1.27mm - Body 4x5mm, IPC Medium Density; Part Description: -30V -19.7A P-Channel MOSFET; Manufacturer Part Number: SI4425DDY-T1-GE3; Pin Count: 8; Case: SOIC8; Mounted: Yes; Socket: No; SMD: Yes; Sense: No; ComponentHeight: 1.75mm; HelpURL: \\cern.ch\dfs\Applications\Altium\Datasheets\SI4425DDY-T1-GE3.pdf; Author: CERN DEM MR; CreateDate: 05/10/2016; LatestRevisionDate: 05/10/2016
T8 = BSH103: as T1 on sheet Cpcis_connectors_P1_P6; Part Number: BSH103; Component Kind: Standard; Component Type: Standard; Device: BSH103; PackageDescription: SOT23, 3 pin, Pitch 0.95mm - 1.3mm W X 2.9mm L X 1.1mm H, IPC Medium Density; Manufacturer Part Number: BSH103; Pin Count: 3; Case: SOT23-3; Mounted: Yes; Socket: No; SMD: Yes; Sense: No; ComponentHeight: 1.1mm; HelpURL: \\cern.ch\dfs\Applications\Altium\Datasheets\BSH103.pdf; Author: CERN DEM JLC; CreateDate: 16.03.2010; LatestRevisionDate: 20.06.2017; ClassName: Artix
TP9-TP11 = SMD_PAD_1.27X1.27MM: as TP1 on sheet Cpcis_connectors_P1_P6; Part Number: SMD_PAD_1.27X1.27MM; Component Kind: Standard (No BOM); Component Type: Standard (No BOM); Pin Count: 1; Family: Test Point; Socket: No; SMD: No; Sense: No; Status: None; ComponentHeight: 0mm; HelpURL: Undefined; Author: CERN DEM JLC; CreateDate: 12.01.2008; LatestRevisionDate: 12.01.2008; PackageDescription: 1.27mm x 1.27mm PCB Copper Area (SMD Test Point)

## Sheet IDC_EXT_CPCIS_interconn_map.SchDoc: DIOT_EEM_Adapter
size 420 x 297 mm; CheckedBy: -; DrawnBy: Marcin Kiepiela; Address1: Warsaw University of Technology; Address2: Nowowiejska 15/19 00-665 Warsaw; DocumentNumber: 6; SheetNumber: 6; SheetTotal: 6; EDA_Number: ARTIQ; Projet: ARTIQ/Sinara/DIOT; ModifiedBy: -; CheckedDate: -; Title2: -; DivGrp: ISE; Designer: Marcin Kiepiela; ModifiedDate: -; ProjectName: DIOT_EEM_Adapter.PrjPCB
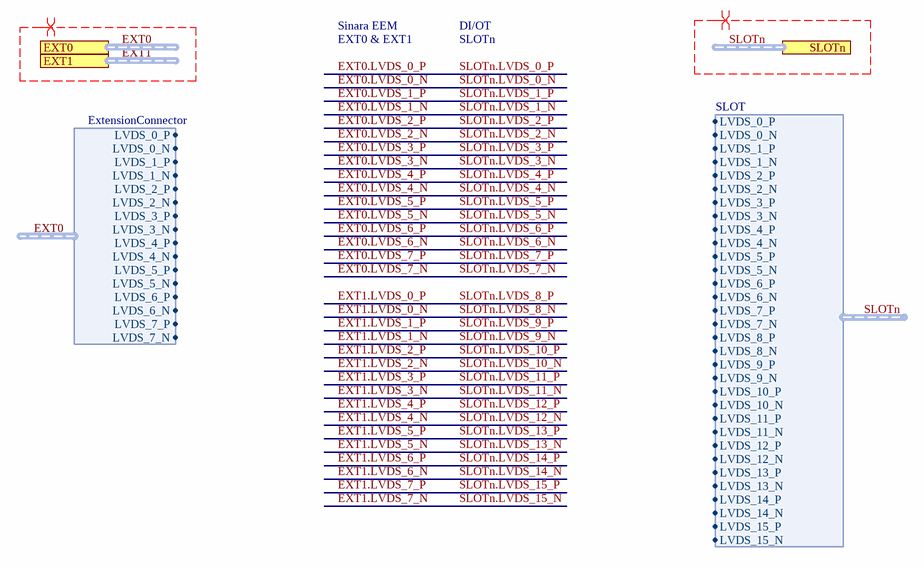
[diagram p5: IDC_EXT_CPCIS_interconn_map.SchDoc]

### Ports
EXT0 (harness ExtensionConnector), EXT1 (harness ExtensionConnector), SLOTn (harness SLOT)

### Harnesses
ExtensionConnector: LVDS_0_N, LVDS_0_P, LVDS_1_N, LVDS_1_P, LVDS_2_N, LVDS_2_P, LVDS_3_N, LVDS_3_P, LVDS_4_N, LVDS_4_P, LVDS_5_N, LVDS_5_P, LVDS_6_N, LVDS_6_P, LVDS_7_N, LVDS_7_P
SLOT: LVDS_0_P, LVDS_0_N, LVDS_1_P, LVDS_1_N, LVDS_2_P, LVDS_2_N, LVDS_3_P, LVDS_3_N, LVDS_4_P, LVDS_4_N, LVDS_5_P, LVDS_5_N, LVDS_6_P, LVDS_6_N, LVDS_7_P, LVDS_7_N, LVDS_8_P, LVDS_8_N, LVDS_9_P, LVDS_9_N, LVDS_10_P, LVDS_10_N, LVDS_11_P, LVDS_11_N, LVDS_12_P, LVDS_12_N, LVDS_13_P, LVDS_13_N, LVDS_14_P, LVDS_14_N, LVDS_15_P, LVDS_15_N

### Buses and harness runs
harness EXT0 = port EXT0
harness EXT1 = port EXT1
harness SLOTn = port SLOTn

### Layout directives
differential pair: EXT0, EXT1, SLOTn

### Notes on the sheet
- EXT0 & EXT1
- Sinara EEM
- SLOTn
- DI/OT
- Project/Equipment
- Document
- Designer
- Drawn by
- Check.by
- Copyright WUT 2023.
  This document describes Open Hardware and is licensed under the CERN-OHL-W v2
  You may redistribute and modify this documentation and make products using it under the terms of the CERN-OHL-W v2 (https:/cern.ch/cern-ohl). This documentation is distributed WITHOUT ANY EXPRESS OR IMPLIED WARRANTY, INCLUDING OF MERCHANTABILITY, SATISFACTORY QUALITY AND FITNESS FOR A PARTICULAR PURPOSE. Please see the CERN-OHL-W v2 for applicable conditions.
  Source location: https://github.com/sinara-hw/EEM_FMC_Carrier
  As per CERN-OHL-W v2 section 4, should You produce hardware based on these sources, You must maintain the Source Location visible on the silkscreen or top copper for a EEM FMC Carrier PCB or other product you make using this documentation.
- Contact:
- File
- Last Mod.
- Print Date
- Sheet
- Size
- A3
- of
- Rev

## Nets that join several sheets
EXT_P12V0: IDC_EXT_Connectors (J4.28 J4.29 J5.28 J5.29), Supply (6 pins)
GND: DIOT_EEM_Adapter (9 pins), ID_logic (29 pins), IDC_EXT_Connectors (20 pins), Cpcis_connectors_P1_P6 (100 pins), Supply (10 pins)
P3V3_MP: ID_logic (29 pins), IDC_EXT_Connectors (J4.30 J5.30), Cpcis_connectors_P1_P6 (28 pins), Supply (5 pins)
P5V0_MP: Cpcis_connectors_P1_P6 (J1.B1), Supply (C23.2 IC14.1 IC14.3)
P12V0: ID_logic (R39.2), Cpcis_connectors_P1_P6 (7 pins), Supply (8 pins)
BP_SCL: ID_logic (IC9.6), Cpcis_connectors_P1_P6 (D1.4 J1.B2)
BP_SDA: ID_logic (IC9.5), Cpcis_connectors_P1_P6 (D1.6 J1.C2)
CK_MMCX_IN_N: DIOT_EEM_Adapter (C21.1 TR1.4), Cpcis_connectors_P1_P6 (J1.F4)
CK_MMCX_IN_P: DIOT_EEM_Adapter (C19.2 TR1.6), Cpcis_connectors_P1_P6 (J1.E4)
EEM_P12V0_En: ID_logic (IC12.14), Supply (R52.2 T8.1)
EXT_P12V0_Force_En: ID_logic (SW1.4), Supply (R48.1 T8.3)
GA0: ID_logic (IC12.4 R33.1), Cpcis_connectors_P1_P6 (R1.1)
GA1: ID_logic (IC12.5 R34.1), Cpcis_connectors_P1_P6 (R2.1)
GA2: ID_logic (IC12.6 R35.1), Cpcis_connectors_P1_P6 (R7.1)
GA3: ID_logic (IC12.7 R37.1), Cpcis_connectors_P1_P6 (R11.1)
I2C0_SCL: ID_logic (IC8.2 IC8.3), IDC_EXT_Connectors (D5.5 J4.27)
I2C0_SDA: ID_logic (IC8.9 IC8.10), IDC_EXT_Connectors (D5.4 J4.26)
I2C1_SCL: ID_logic (IC10.2 IC10.3), IDC_EXT_Connectors (D5.1 J5.27)
I2C1_SDA: ID_logic (IC10.9 IC10.10), IDC_EXT_Connectors (D5.3 J5.26)
JTAG_SEL: ID_logic (R27.1 T3.3), Cpcis_connectors_P1_P6 (5 pins)
SERVMOD: ID_logic (IC9.8 T2.1), Cpcis_connectors_P1_P6 (R9.1 R12.2)
SHARED_BUS_0: ID_logic (TP3.1), Cpcis_connectors_P1_P6 (R6.1)
SHARED_BUS_1: ID_logic (TP4.1), Cpcis_connectors_P1_P6 (R3.1)
SHARED_BUS_2: ID_logic (TP5.1), Cpcis_connectors_P1_P6 (R5.1)
SHARED_BUS_3: ID_logic (TP6.1), Cpcis_connectors_P1_P6 (R8.1)
SHARED_BUS_4: ID_logic (TP7.1), Cpcis_connectors_P1_P6 (R10.1)

## Assembly variants
Line_15__MGT: not fitted R13 R15 R53
Line_15__LVDS: not fitted R14 R16 R53